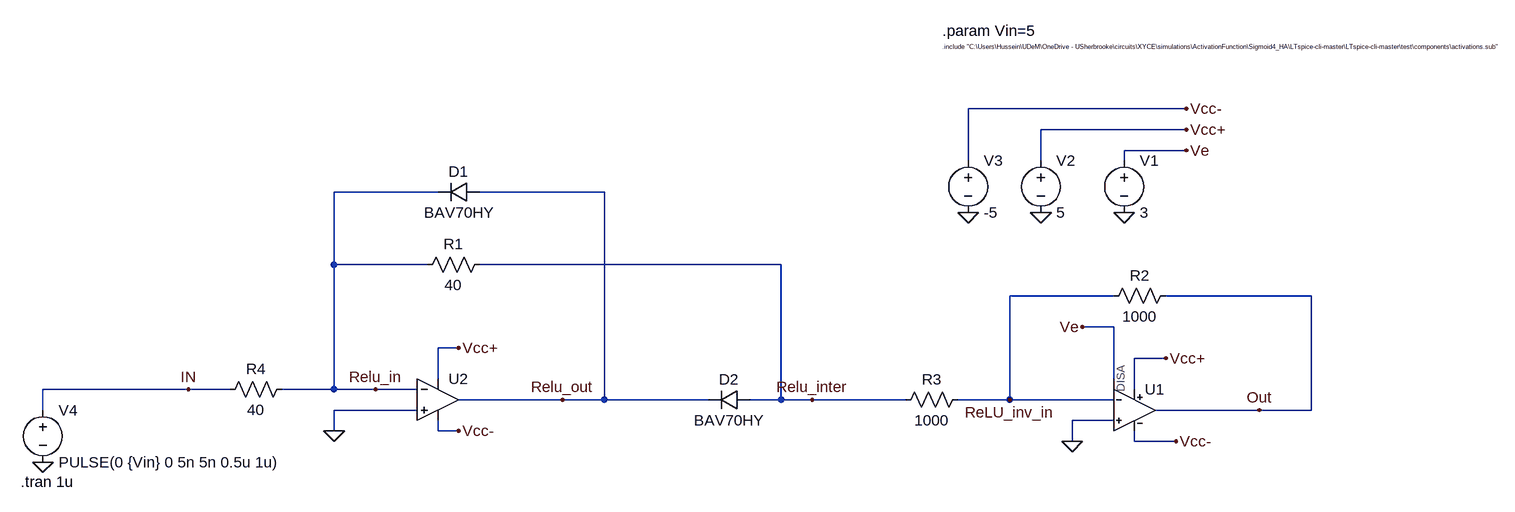
[diagram p0: schematic RelU.asc]
RelU.asc, the LTspice schematic file:
Version 4
SHEET 1 1168 680
WIRE 592 -240 256 -240
WIRE 592 -208 368 -208
WIRE 592 -176 496 -176
WIRE 256 -160 256 -240
WIRE 368 -160 368 -208
WIRE 496 -160 496 -176
WIRE -560 -112 -720 -112
WIRE -304 -112 -496 -112
WIRE -720 0 -720 -112
WIRE -576 0 -720 0
WIRE -32 0 -496 0
WIRE 480 48 320 48
WIRE 784 48 560 48
WIRE 480 96 432 96
WIRE -528 128 -560 128
WIRE 560 144 512 144
WIRE -560 176 -560 128
WIRE 480 176 480 96
WIRE -944 192 -1168 192
WIRE -880 192 -944 192
WIRE -720 192 -720 0
WIRE -720 192 -800 192
WIRE -656 192 -720 192
WIRE -592 192 -656 192
WIRE 512 192 512 144
WIRE -368 208 -528 208
WIRE -304 208 -304 -112
WIRE -304 208 -368 208
WIRE -144 208 -304 208
WIRE -32 208 -32 0
WIRE -32 208 -80 208
WIRE 16 208 -32 208
WIRE 160 208 16 208
WIRE 320 208 320 48
WIRE 320 208 240 208
WIRE 480 208 320 208
WIRE -1168 224 -1168 192
WIRE -592 224 -720 224
WIRE 704 224 544 224
WIRE 784 224 784 48
WIRE 784 224 704 224
WIRE 480 240 416 240
WIRE -720 256 -720 224
WIRE -560 256 -560 240
WIRE -528 256 -560 256
WIRE 416 272 416 240
WIRE 512 272 512 256
WIRE 576 272 512 272
FLAG 560 144 Vcc+
FLAG 576 272 Vcc-
FLAG 432 96 Ve
FLAG 496 -80 0
FLAG 368 -80 0
FLAG 256 -80 0
FLAG 592 -240 Vcc-
FLAG 592 -208 Vcc+
FLAG 592 -176 Ve
FLAG -528 256 Vcc-
FLAG -528 128 Vcc+
FLAG -720 256 0
FLAG 416 272 0
FLAG -1168 304 0
FLAG -944 192 IN
FLAG -656 192 Relu_in
FLAG -368 208 Relu_out
FLAG 16 208 Relu_inter
FLAG 704 224 Out
FLAG 320 208 ReLU_inv_in
SYMBOL MySym\\opamp2_custom 512 160 R0
WINDOW 3 16 96 Invisible 2
SYMATTR Value ""
SYMATTR InstName U1
SYMATTR SpiceModel OPA684_0
SYMBOL voltage 496 -176 R0
WINDOW 123 0 0 Left 0
WINDOW 39 0 0 Left 0
SYMATTR InstName V1
SYMATTR Value 3
SYMBOL voltage 368 -176 R0
WINDOW 123 0 0 Left 0
WINDOW 39 0 0 Left 0
SYMATTR InstName V2
SYMATTR Value 5
SYMBOL voltage 256 -176 R0
WINDOW 123 0 0 Left 0
WINDOW 39 0 0 Left 0
SYMATTR InstName V3
SYMATTR Value -5
SYMBOL OpAmps\\opamp2 -560 144 R0
WINDOW 3 16 96 Invisible 2
SYMATTR Value ""
SYMATTR InstName U2
SYMATTR SpiceModel MAX4223
SYMBOL res -480 -16 R90
WINDOW 0 0 56 VBottom 2
WINDOW 3 32 56 VTop 2
SYMATTR InstName R1
SYMATTR Value 40
SYMBOL res 576 32 R90
WINDOW 0 0 56 VBottom 2
WINDOW 3 32 56 VTop 2
SYMATTR InstName R2
SYMATTR Value 1000
SYMBOL res 256 192 R90
WINDOW 0 0 56 VBottom 2
WINDOW 3 32 56 VTop 2
SYMATTR InstName R3
SYMATTR Value 1000
SYMBOL res -784 176 R90
WINDOW 0 0 56 VBottom 2
WINDOW 3 32 56 VTop 2
SYMATTR InstName R4
SYMATTR Value 40
SYMBOL voltage -1168 208 R0
WINDOW 123 0 0 Left 0
WINDOW 39 0 0 Left 0
SYMATTR InstName V4
SYMATTR Value PULSE(0 {Vin} 0 5n 5n 0.5u 1u)
SYMBOL diode -496 -128 R90
WINDOW 0 0 32 VBottom 2
WINDOW 3 32 32 VTop 2
SYMATTR InstName D1
SYMATTR Value BAV70HY
SYMBOL diode -80 192 R90
WINDOW 0 0 32 VBottom 2
WINDOW 3 32 32 VTop 2
SYMATTR InstName D2
SYMATTR Value BAV70HY
TEXT 216 -336 Left 0 !.include "C:\\Users\\Hussein\\UDeM\\OneDrive - USherbrooke\\circuits\\XYCE\\simulations\\ActivationFunction\\Sigmoid4_HA\\LTspice-cli-master\\LTspice-cli-master\\test\\components\\activations.sub"
TEXT 216 -360 Left 2 !.param Vin=5
TEXT -1202 334 Left 2 !.tran 1u

The netlist it stands for:
* RelU.asc
XU1 0 ReLU_inv_in Vcc+ Vcc- Out Ve OPA684_0  ; pins In+ In- V+ V- OUT DISA
V1 Ve 0 3
V2 Vcc+ 0 5
V3 Vcc- 0 -5
XU2 0 Relu_in Vcc+ Vcc- Relu_out MAX4223  ; pins In+ In- V+ V- OUT
R1 Relu_inter Relu_in 40
R2 Out ReLU_inv_in 1000
R3 ReLU_inv_in Relu_inter 1000
R4 Relu_in IN 40
V4 IN 0 PULSE(0 {Vin} 0 5n 5n 0.5u 1u)
D1 Relu_out Relu_in BAV70HY
D2 Relu_inter Relu_out BAV70HY
.model D D
.lib standard.dio
.include "C:\Users\Hussein\UDeM\OneDrive - USherbrooke\circuits\XYCE\simulations\ActivationFunction\Sigmoid4_HA\LTspice-cli-master\LTspice-cli-master\test\components\activations.sub"
.param Vin=5
.tran 1u
.backanno
.end

* Results of the author's LTspice run, read from the files saved beside the schematic
* Operating Point, zero values left out:
*   V(ve) = 3 V
*   V(vcc-) = -5 V
*   V(vcc+) = 5 V
*   V(out) = 3.13 mV
*   V(relu_inv_in) = -426.8 µV
*   V(relu_in) = 5.927 µV
*   V(relu_out) = -340.5 mV
*   V(relu_inter) = -122.3 µV
*   I(D1) = -3.777 nA
*   I(D2) = 2.9 µA
*   I(R1) = -3.205 µA
*   I(R2) = 3.557 µA
*   I(R3) = -304.5 nA
*   I(R4) = 148.2 nA
*   I(V1) = -2.803 nA
*   I(V2) = -5.538 mA
*   I(V3) = 3.542 mA
*   I(V4) = 148.2 nA
*   Ix(u1:+) = 37.1 µA
*   Ix(u1:-) = 3.861 µA
*   Ix(u1:V+) = 826 µA
*   Ix(u1:V-) = -827.6 µA
*   Ix(u1:OUT) = -3.557 µA
*   Ix(u1:DISA) = 2.803 nA
*   Ix(u2:1) = 3.5 µA
*   Ix(u2:2) = -3.356 µA
*   Ix(u2:99) = 4.712 mA
*   Ix(u2:50) = -2.715 mA
*   Ix(u2:40) = 2.904 µA
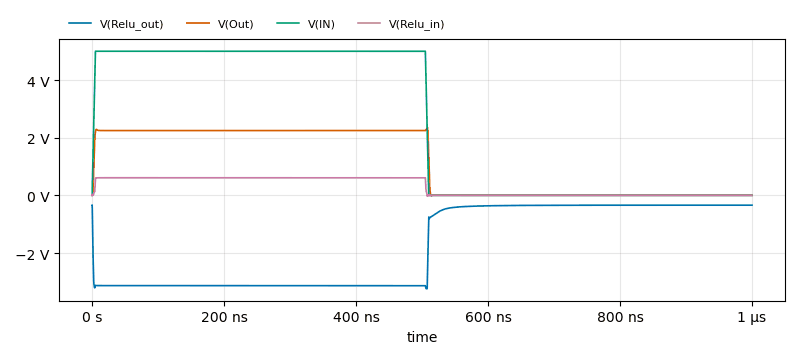
[diagram p1: Transient Analysis of RelU.asc, plotted from the saved traces]
* Transient Analysis, 1 run:
*   V(Relu_out): min -3.243 V, max -334.5 mV, average -1.77 V, rms 2.245 V, last -340.5 mV
*   V(Out): min -16.41 mV, max 2.354 V, average 1.143 V, rms 1.6 V, last 3.13 mV
*   V(IN): min 0 V, max 5 V, average 2.525 V, rms 3.547 V, last 0 V
*   V(Relu_in): min -27.78 mV, max 611.1 mV, average 306.6 mV, rms 432.5 mV, last 5.925 µV